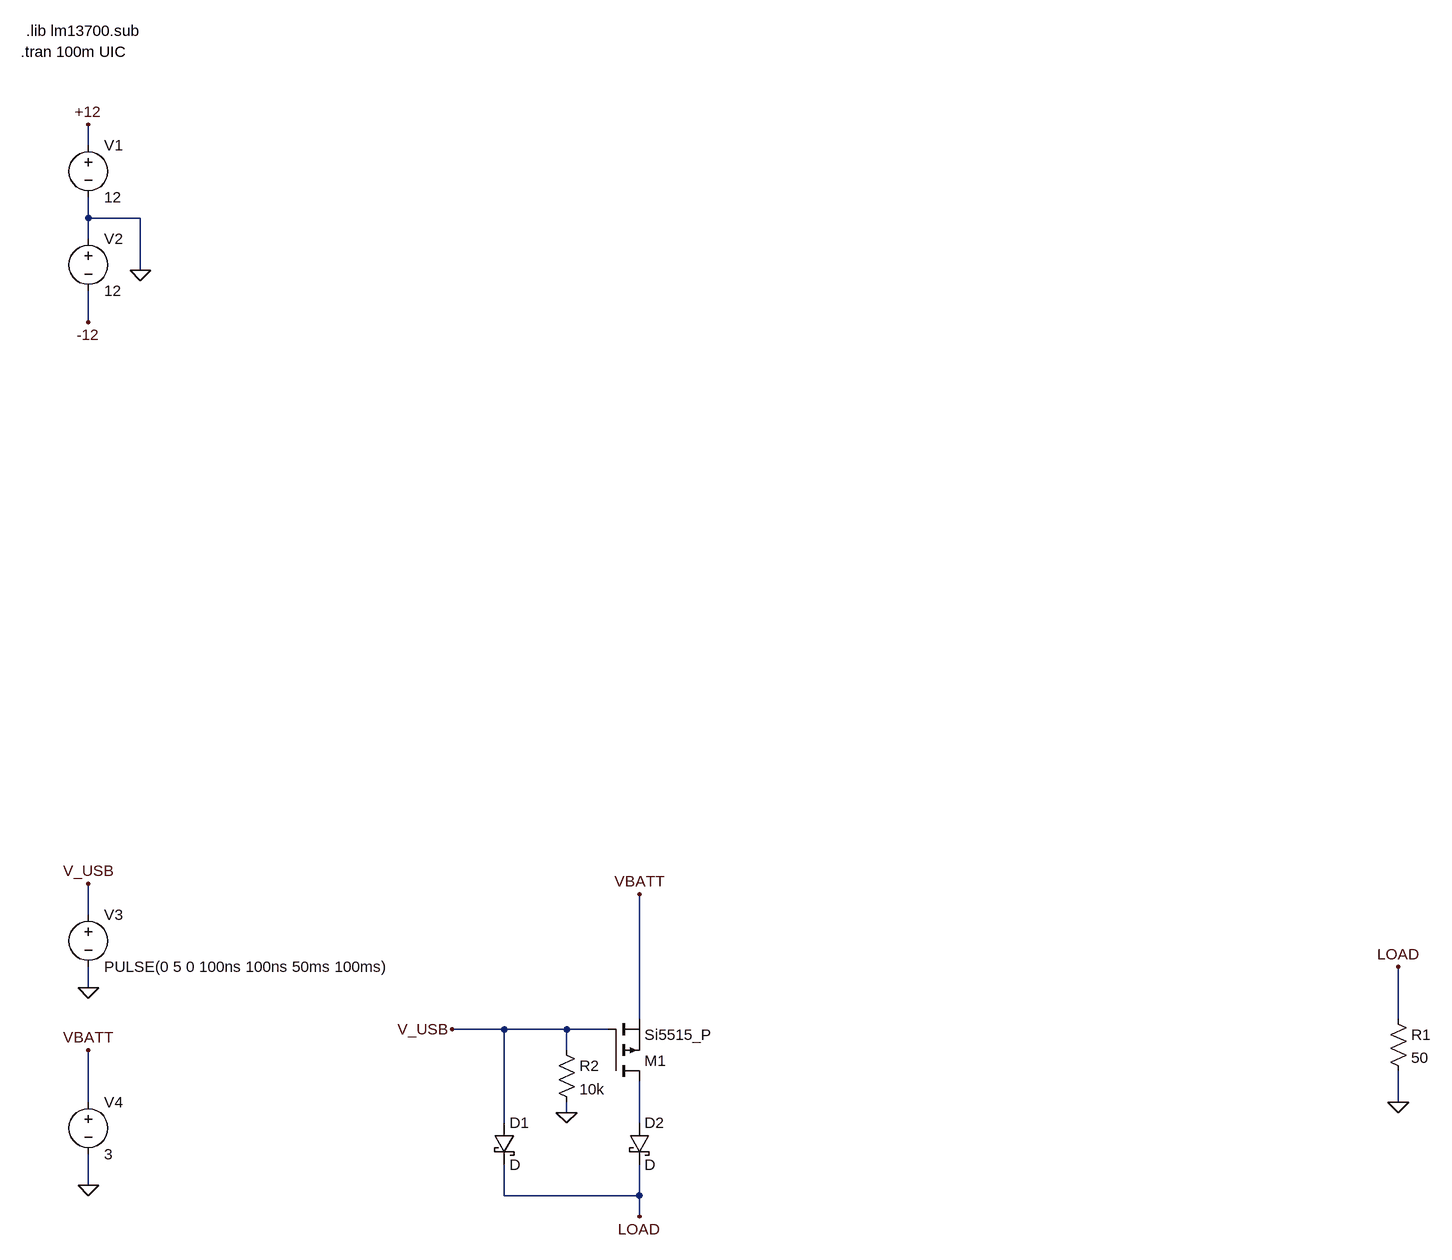
[diagram p0: schematic PowerSwitchSim.asc]
PowerSwitchSim.asc, the LTspice schematic file:
Version 4
SHEET 1 3368 3520
WIRE 64 256 64 224
WIRE 64 368 64 336
WIRE 144 368 64 368
WIRE 64 400 64 368
WIRE 144 448 144 368
WIRE 64 528 64 480
WIRE 64 1440 64 1392
WIRE 64 1552 64 1520
WIRE 912 1600 912 1408
WIRE 2080 1600 2080 1520
WIRE 704 1616 624 1616
WIRE 800 1616 704 1616
WIRE 864 1616 800 1616
WIRE 800 1648 800 1616
WIRE 64 1728 64 1648
WIRE 2080 1728 2080 1680
WIRE 800 1744 800 1728
WIRE 704 1760 704 1616
WIRE 912 1760 912 1696
WIRE 64 1856 64 1808
WIRE 704 1872 704 1824
WIRE 912 1872 912 1824
WIRE 912 1872 704 1872
WIRE 912 1904 912 1872
FLAG 64 224 +12
FLAG 64 528 -12
FLAG 144 448 0
FLAG 64 1552 0
FLAG 64 1392 V_USB
FLAG 64 1856 0
FLAG 64 1648 VBATT
FLAG 2080 1728 0
FLAG 2080 1520 LOAD
FLAG 912 1408 VBATT
FLAG 912 1904 LOAD
FLAG 624 1616 V_USB
FLAG 800 1744 0
SYMBOL voltage 64 240 R0
SYMATTR InstName V1
SYMATTR Value 12
SYMBOL voltage 64 384 R0
SYMATTR InstName V2
SYMATTR Value 12
SYMBOL voltage 64 1424 R0
SYMATTR InstName V3
SYMATTR Value PULSE(0 5 0 100ns 100ns 50ms 100ms)
SYMBOL voltage 64 1712 R0
SYMATTR InstName V4
SYMATTR Value 3
SYMBOL res 2064 1584 R0
SYMATTR InstName R1
SYMATTR Value 50
SYMBOL pmos 864 1696 M180
SYMATTR InstName M1
SYMATTR Value Si5515_P
SYMBOL res 784 1632 R0
SYMATTR InstName R2
SYMATTR Value 10k
SYMBOL schottky 688 1760 R0
SYMATTR InstName D1
SYMBOL schottky 896 1760 R0
SYMATTR InstName D2
TEXT -40 112 Left 2 !.tran 100m UIC
TEXT -32 80 Left 2 !.lib lm13700.sub

The netlist it stands for:
* PowerSwitchSim.asc
V1 +12 0 12
V2 0 -12 12
V3 V_USB 0 PULSE(0 5 0 100ns 100ns 50ms 100ms)
V4 VBATT 0 3
R1 LOAD 0 50
M1 N001 V_USB VBATT VBATT Si5515_P
R2 V_USB 0 10k
D1 V_USB LOAD D
D2 N001 LOAD D
.model D D
.lib standard.dio
.model NMOS NMOS
.model PMOS PMOS
.lib standard.mos
.tran 100m UIC
.lib lm13700.sub
.backanno
.end